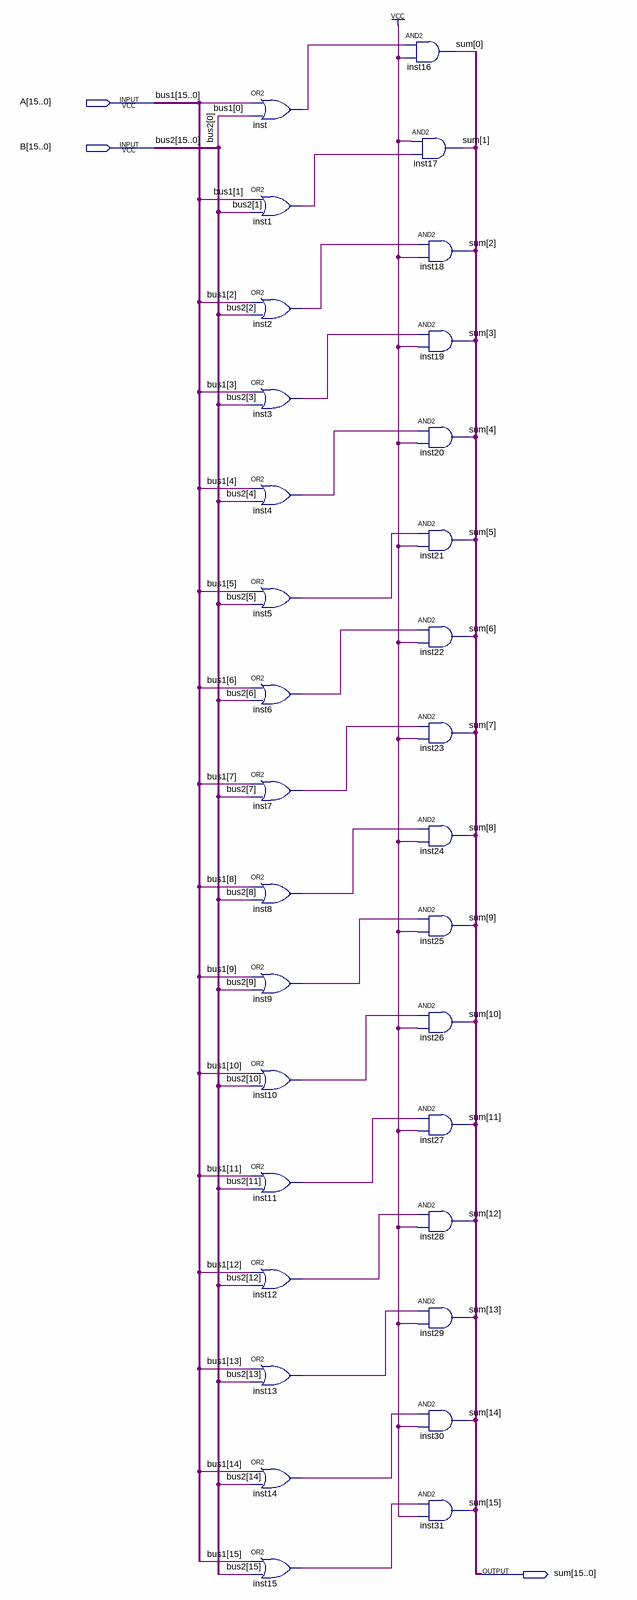
[diagram p0: schematic sheet]
// Quartus schematic orer16bit.bdf as structural Verilog: 32 symbols, 3 pins
module orer16bit (
  input  [15:0] A,
  input  [15:0] B,
  output [15:0] sum
);

  wire inst1_out, inst2_out, inst3_out, inst4_out, inst5_out, inst6_out, inst7_out, inst8_out, inst9_out,
       inst10_out, inst11_out, inst12_out, inst13_out, inst14_out, inst15_out, inst_out;

  or inst (inst_out, A[0], B[0]);
  or inst1 (inst1_out, A[1], B[1]);
  or inst2 (inst2_out, A[2], B[2]);
  or inst3 (inst3_out, A[3], B[3]);
  or inst4 (inst4_out, A[4], B[4]);
  or inst5 (inst5_out, A[5], B[5]);
  or inst6 (inst6_out, A[6], B[6]);
  or inst7 (inst7_out, A[7], B[7]);
  or inst8 (inst8_out, A[8], B[8]);
  or inst9 (inst9_out, A[9], B[9]);
  or inst10 (inst10_out, A[10], B[10]);
  or inst11 (inst11_out, A[11], B[11]);
  or inst12 (inst12_out, A[12], B[12]);
  or inst13 (inst13_out, A[13], B[13]);
  or inst14 (inst14_out, A[14], B[14]);
  or inst15 (inst15_out, A[15], B[15]);
  and inst16 (sum[0], inst_out, 1'b1);
  and inst17 (sum[1], 1'b1, inst1_out);
  and inst18 (sum[2], inst2_out, 1'b1);
  and inst19 (sum[3], inst3_out, 1'b1);
  and inst20 (sum[4], inst4_out, 1'b1);
  and inst21 (sum[5], inst5_out, 1'b1);
  and inst22 (sum[6], inst6_out, 1'b1);
  and inst23 (sum[7], inst7_out, 1'b1);
  and inst24 (sum[8], inst8_out, 1'b1);
  and inst25 (sum[9], inst9_out, 1'b1);
  and inst26 (sum[10], inst10_out, 1'b1);
  and inst27 (sum[11], inst11_out, 1'b1);
  and inst28 (sum[12], inst12_out, 1'b1);
  and inst29 (sum[13], inst13_out, 1'b1);
  and inst30 (sum[14], inst14_out, 1'b1);
  and inst31 (sum[15], inst15_out, 1'b1);

  // Other names for the same wires on the sheet: bus1[15:0] = A; bus2[15:0] = B
endmodule
